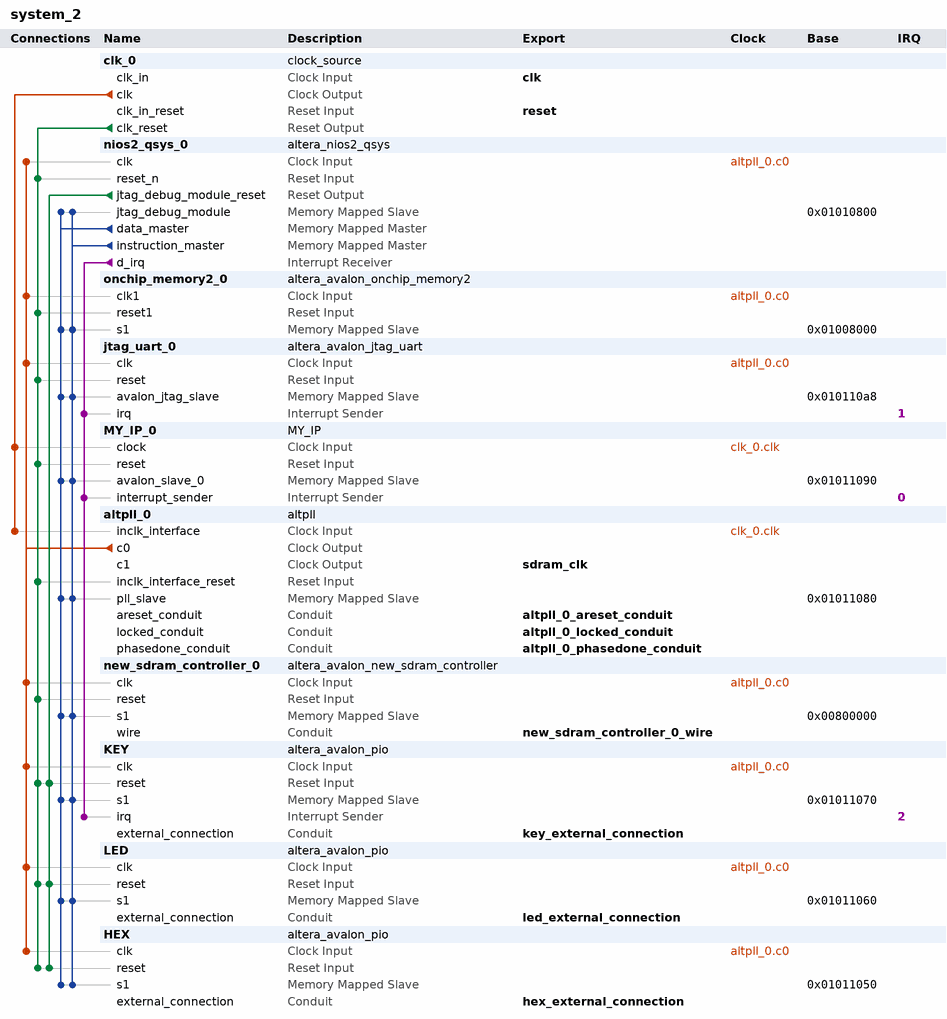
[diagram p0: system contents]
# Platform Designer (Qsys) system system_2, Cyclone II EP2C35F672C6
# Parameters at their usual value, and those the tool derives, are not listed.
package require -exact qsys 13.0.1.99.2
create_system system_2
set_project_property DEVICE_FAMILY {Cyclone II}
set_project_property DEVICE EP2C35F672C6

add_instance clk_0 clock_source 13.0
set_instance_parameter_value clk_0 clockFrequency 50000000

add_instance nios2_qsys_0 altera_nios2_qsys 13.0
set_instance_parameter_value nios2_qsys_0 resetSlave onchip_memory2_0.s1
set_instance_parameter_value nios2_qsys_0 mmu_TLBMissExcSlave None
set_instance_parameter_value nios2_qsys_0 exceptionSlave onchip_memory2_0.s1
set_instance_parameter_value nios2_qsys_0 breakSlave nios2_qsys_0.jtag_debug_module
set_instance_parameter_value nios2_qsys_0 impl Tiny
set_instance_parameter_value nios2_qsys_0 icache_size 4096

add_instance onchip_memory2_0 altera_avalon_onchip_memory2 13.0.1.99.2
set_instance_parameter_value onchip_memory2_0 dataWidth 32
set_instance_parameter_value onchip_memory2_0 dualPort false
set_instance_parameter_value onchip_memory2_0 initMemContent true
set_instance_parameter_value onchip_memory2_0 initializationFileName onchip_mem.hex
set_instance_parameter_value onchip_memory2_0 memorySize 32768

add_instance jtag_uart_0 altera_avalon_jtag_uart 13.0.1.99.2
set_instance_parameter_value jtag_uart_0 simInteractiveOptions NO_INTERACTIVE_WINDOWS

add_instance MY_IP_0 MY_IP 1.0
set_instance_parameter_value MY_IP_0 IMG_WIDTH 256
set_instance_parameter_value MY_IP_0 IMG_HEIGHT 256
set_instance_parameter_value MY_IP_0 FIFO_DEPTH 256

add_instance altpll_0 altpll 13.0
set_instance_parameter_value altpll_0 INCLK0_INPUT_FREQUENCY 20000
set_instance_parameter_value altpll_0 GATE_LOCK_SIGNAL NO
set_instance_parameter_value altpll_0 VALID_LOCK_MULTIPLIER 1
set_instance_parameter_value altpll_0 INVALID_LOCK_MULTIPLIER 5
set_instance_parameter_value altpll_0 CLK0_MULTIPLY_BY 2
set_instance_parameter_value altpll_0 CLK1_MULTIPLY_BY 2
set_instance_parameter_value altpll_0 CLK0_DIVIDE_BY 1
set_instance_parameter_value altpll_0 CLK1_DIVIDE_BY 1
set_instance_parameter_value altpll_0 CLK1_PHASE_SHIFT -3000
set_instance_parameter_value altpll_0 CLK1_DUTY_CYCLE 50
set_instance_parameter_value altpll_0 PORT_clk1 PORT_USED
set_instance_parameter_value altpll_0 PORT_clk2 PORT_UNUSED
set_instance_parameter_value altpll_0 PORT_clk3 PORT_UNUSED
set_instance_parameter_value altpll_0 PORT_ARESET PORT_USED
set_instance_parameter_value altpll_0 PORT_LOCKED PORT_USED

add_instance new_sdram_controller_0 altera_avalon_new_sdram_controller 13.0.1.99.2
set_instance_parameter_value new_sdram_controller_0 TAC 5.5
set_instance_parameter_value new_sdram_controller_0 TRCD 20.0
set_instance_parameter_value new_sdram_controller_0 TRP 20.0
set_instance_parameter_value new_sdram_controller_0 casLatency 3
set_instance_parameter_value new_sdram_controller_0 columnWidth 8
set_instance_parameter_value new_sdram_controller_0 dataWidth 16
set_instance_parameter_value new_sdram_controller_0 generateSimulationModel false
set_instance_parameter_value new_sdram_controller_0 model single_Micron_MT48LC4M32B2_7_chip
set_instance_parameter_value new_sdram_controller_0 numberOfBanks 4
set_instance_parameter_value new_sdram_controller_0 numberOfChipSelects 1
set_instance_parameter_value new_sdram_controller_0 powerUpDelay 100.0
set_instance_parameter_value new_sdram_controller_0 refreshPeriod 15.625
set_instance_parameter_value new_sdram_controller_0 rowWidth 12

add_instance KEY altera_avalon_pio 13.0.1.99.2
set_instance_parameter_value KEY captureEdge true
set_instance_parameter_value KEY direction Input
set_instance_parameter_value KEY edgeType FALLING
set_instance_parameter_value KEY generateIRQ true
set_instance_parameter_value KEY irqType EDGE
set_instance_parameter_value KEY width 4

add_instance LED altera_avalon_pio 13.0.1.99.2
set_instance_parameter_value LED direction Output
set_instance_parameter_value LED width 10

add_instance HEX altera_avalon_pio 13.0.1.99.2
set_instance_parameter_value HEX direction Output
set_instance_parameter_value HEX width 32

# connections
add_connection altpll_0.c0 HEX.clk clock
add_connection altpll_0.c0 jtag_uart_0.clk clock
add_connection altpll_0.c0 KEY.clk clock
add_connection altpll_0.c0 LED.clk clock
add_connection altpll_0.c0 new_sdram_controller_0.clk clock
add_connection altpll_0.c0 nios2_qsys_0.clk clock
add_connection altpll_0.c0 onchip_memory2_0.clk1 clock
add_connection clk_0.clk altpll_0.inclk_interface clock
add_connection clk_0.clk MY_IP_0.clock clock
add_connection clk_0.clk_reset altpll_0.inclk_interface_reset reset
add_connection clk_0.clk_reset HEX.reset reset
add_connection clk_0.clk_reset jtag_uart_0.reset reset
add_connection clk_0.clk_reset KEY.reset reset
add_connection clk_0.clk_reset LED.reset reset
add_connection clk_0.clk_reset MY_IP_0.reset reset
add_connection clk_0.clk_reset new_sdram_controller_0.reset reset
add_connection clk_0.clk_reset nios2_qsys_0.reset_n reset
add_connection clk_0.clk_reset onchip_memory2_0.reset1 reset
add_connection nios2_qsys_0.jtag_debug_module_reset HEX.reset reset
add_connection nios2_qsys_0.jtag_debug_module_reset KEY.reset reset
add_connection nios2_qsys_0.jtag_debug_module_reset LED.reset reset
add_connection nios2_qsys_0.data_master altpll_0.pll_slave avalon
set_connection_parameter_value nios2_qsys_0.data_master/altpll_0.pll_slave baseAddress 0x01011080
add_connection nios2_qsys_0.data_master HEX.s1 avalon
set_connection_parameter_value nios2_qsys_0.data_master/HEX.s1 baseAddress 0x01011050
add_connection nios2_qsys_0.data_master jtag_uart_0.avalon_jtag_slave avalon
set_connection_parameter_value nios2_qsys_0.data_master/jtag_uart_0.avalon_jtag_slave baseAddress 0x010110a8
add_connection nios2_qsys_0.data_master KEY.s1 avalon
set_connection_parameter_value nios2_qsys_0.data_master/KEY.s1 baseAddress 0x01011070
add_connection nios2_qsys_0.data_master LED.s1 avalon
set_connection_parameter_value nios2_qsys_0.data_master/LED.s1 baseAddress 0x01011060
add_connection nios2_qsys_0.data_master MY_IP_0.avalon_slave_0 avalon
set_connection_parameter_value nios2_qsys_0.data_master/MY_IP_0.avalon_slave_0 baseAddress 0x01011090
add_connection nios2_qsys_0.data_master new_sdram_controller_0.s1 avalon
set_connection_parameter_value nios2_qsys_0.data_master/new_sdram_controller_0.s1 baseAddress 0x00800000
add_connection nios2_qsys_0.data_master nios2_qsys_0.jtag_debug_module avalon
set_connection_parameter_value nios2_qsys_0.data_master/nios2_qsys_0.jtag_debug_module baseAddress 0x01010800
add_connection nios2_qsys_0.data_master onchip_memory2_0.s1 avalon
set_connection_parameter_value nios2_qsys_0.data_master/onchip_memory2_0.s1 baseAddress 0x01008000
add_connection nios2_qsys_0.instruction_master altpll_0.pll_slave avalon
set_connection_parameter_value nios2_qsys_0.instruction_master/altpll_0.pll_slave baseAddress 0x01011080
add_connection nios2_qsys_0.instruction_master HEX.s1 avalon
set_connection_parameter_value nios2_qsys_0.instruction_master/HEX.s1 baseAddress 0x01011050
add_connection nios2_qsys_0.instruction_master jtag_uart_0.avalon_jtag_slave avalon
set_connection_parameter_value nios2_qsys_0.instruction_master/jtag_uart_0.avalon_jtag_slave baseAddress 0x010110a8
add_connection nios2_qsys_0.instruction_master KEY.s1 avalon
set_connection_parameter_value nios2_qsys_0.instruction_master/KEY.s1 baseAddress 0x01011070
add_connection nios2_qsys_0.instruction_master LED.s1 avalon
set_connection_parameter_value nios2_qsys_0.instruction_master/LED.s1 baseAddress 0x01011060
add_connection nios2_qsys_0.instruction_master MY_IP_0.avalon_slave_0 avalon
set_connection_parameter_value nios2_qsys_0.instruction_master/MY_IP_0.avalon_slave_0 baseAddress 0x01011090
add_connection nios2_qsys_0.instruction_master new_sdram_controller_0.s1 avalon
set_connection_parameter_value nios2_qsys_0.instruction_master/new_sdram_controller_0.s1 baseAddress 0x00800000
add_connection nios2_qsys_0.instruction_master nios2_qsys_0.jtag_debug_module avalon
set_connection_parameter_value nios2_qsys_0.instruction_master/nios2_qsys_0.jtag_debug_module baseAddress 0x01010800
add_connection nios2_qsys_0.instruction_master onchip_memory2_0.s1 avalon
set_connection_parameter_value nios2_qsys_0.instruction_master/onchip_memory2_0.s1 baseAddress 0x01008000
add_connection nios2_qsys_0.d_irq jtag_uart_0.irq interrupt
set_connection_parameter_value nios2_qsys_0.d_irq/jtag_uart_0.irq irqNumber 1
add_connection nios2_qsys_0.d_irq KEY.irq interrupt
set_connection_parameter_value nios2_qsys_0.d_irq/KEY.irq irqNumber 2
add_connection nios2_qsys_0.d_irq MY_IP_0.interrupt_sender interrupt
set_connection_parameter_value nios2_qsys_0.d_irq/MY_IP_0.interrupt_sender irqNumber 0

# exported interfaces
add_interface reset reset sink
set_interface_property reset EXPORT_OF clk_0.clk_in_reset
add_interface new_sdram_controller_0_wire conduit end
set_interface_property new_sdram_controller_0_wire EXPORT_OF new_sdram_controller_0.wire
add_interface clk clock sink
set_interface_property clk EXPORT_OF clk_0.clk_in
add_interface key_external_connection conduit end
set_interface_property key_external_connection EXPORT_OF KEY.external_connection
add_interface led_external_connection conduit end
set_interface_property led_external_connection EXPORT_OF LED.external_connection
add_interface hex_external_connection conduit end
set_interface_property hex_external_connection EXPORT_OF HEX.external_connection
add_interface altpll_0_areset_conduit conduit end
set_interface_property altpll_0_areset_conduit EXPORT_OF altpll_0.areset_conduit
add_interface altpll_0_locked_conduit conduit end
set_interface_property altpll_0_locked_conduit EXPORT_OF altpll_0.locked_conduit
add_interface altpll_0_phasedone_conduit conduit end
set_interface_property altpll_0_phasedone_conduit EXPORT_OF altpll_0.phasedone_conduit
add_interface sdram_clk clock source
set_interface_property sdram_clk EXPORT_OF altpll_0.c1

set_interconnect_requirement {$system} qsys_mm.clockCrossingAdapter HANDSHAKE
set_interconnect_requirement {$system} qsys_mm.maxAdditionalLatency 1

save_system system_2.qsys
